# EAGLE design MacroBoard (EAGLE 9.6.2)
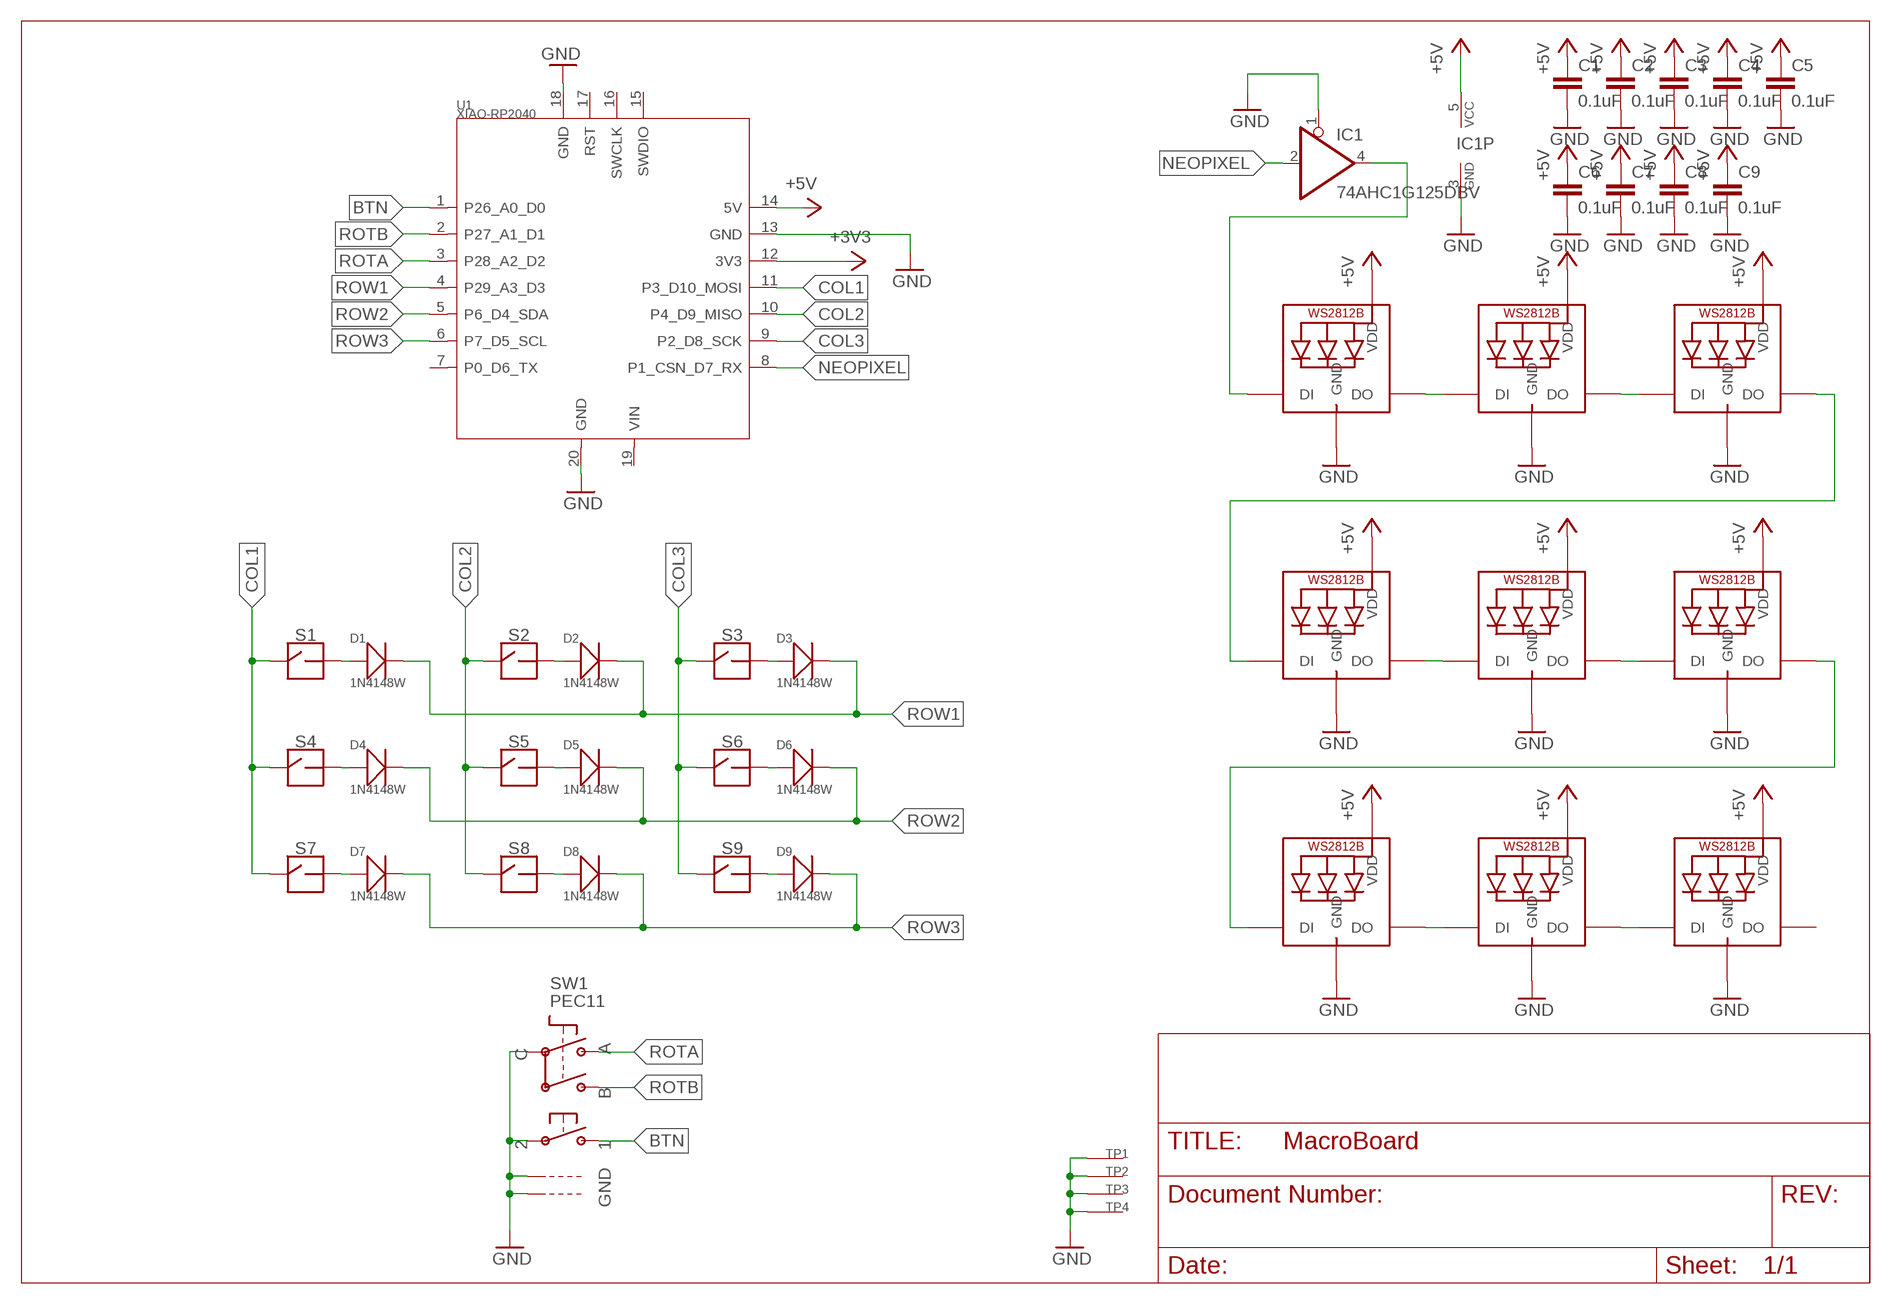
[diagram p0: schematic, sheet 1]

## Parts
C1  0.1uF  C-EUC0805K  [C0805K]
C2  0.1uF  C-EUC0805K  [C0805K]
C3  0.1uF  C-EUC0805K  [C0805K]
C4  0.1uF  C-EUC0805K  [C0805K]
C5  0.1uF  C-EUC0805K  [C0805K]
C6  0.1uF  C-EUC0805K  [C0805K]
C7  0.1uF  C-EUC0805K  [C0805K]
C8  0.1uF  C-EUC0805K  [C0805K]
C9  0.1uF  C-EUC0805K  [C0805K]
D1  1N4148W  SMD-DIODE-SCHOTTKY-20V-1A(SOD-123)  [SOD-123]
D2  1N4148W  SMD-DIODE-SCHOTTKY-20V-1A(SOD-123)  [SOD-123]
D3  1N4148W  SMD-DIODE-SCHOTTKY-20V-1A(SOD-123)  [SOD-123]
D4  1N4148W  SMD-DIODE-SCHOTTKY-20V-1A(SOD-123)  [SOD-123]
D5  1N4148W  SMD-DIODE-SCHOTTKY-20V-1A(SOD-123)  [SOD-123]
D6  1N4148W  SMD-DIODE-SCHOTTKY-20V-1A(SOD-123)  [SOD-123]
D7  1N4148W  SMD-DIODE-SCHOTTKY-20V-1A(SOD-123)  [SOD-123]
D8  1N4148W  SMD-DIODE-SCHOTTKY-20V-1A(SOD-123)  [SOD-123]
D9  1N4148W  SMD-DIODE-SCHOTTKY-20V-1A(SOD-123)  [SOD-123]
IC1  74AHC1G125DBV  [SOT23-5]
LED1  WS2812B_SK6812E  [NEO3535_REVERSE]
LED2  WS2812B_SK6812E  [NEO3535_REVERSE]
LED3  WS2812B_SK6812E  [NEO3535_REVERSE]
LED4  WS2812B_SK6812E  [NEO3535_REVERSE]
LED5  WS2812B_SK6812E  [NEO3535_REVERSE]
LED6  WS2812B_SK6812E  [NEO3535_REVERSE]
LED7  WS2812B_SK6812E  [NEO3535_REVERSE]
LED8  WS2812B_SK6812E  [NEO3535_REVERSE]
LED9  WS2812B_SK6812E  [NEO3535_REVERSE]
S1  SOCKET  KBD_SWITCH_KAILH_SOCKETBOX_JADE_KAILH_SOCKET  [KAILH_SOCKET]
S2  SOCKET  KBD_SWITCH_KAILH_SOCKETBOX_JADE_KAILH_SOCKET  [KAILH_SOCKET]
S3  SOCKET  KBD_SWITCH_KAILH_SOCKETBOX_JADE_KAILH_SOCKET  [KAILH_SOCKET]
S4  SOCKET  KBD_SWITCH_KAILH_SOCKETBOX_JADE_KAILH_SOCKET  [KAILH_SOCKET]
S5  SOCKET  KBD_SWITCH_KAILH_SOCKETBOX_JADE_KAILH_SOCKET  [KAILH_SOCKET]
S6  SOCKET  KBD_SWITCH_KAILH_SOCKETBOX_JADE_KAILH_SOCKET  [KAILH_SOCKET]
S7  SOCKET  KBD_SWITCH_KAILH_SOCKETBOX_JADE_KAILH_SOCKET  [KAILH_SOCKET]
S8  SOCKET  KBD_SWITCH_KAILH_SOCKETBOX_JADE_KAILH_SOCKET  [KAILH_SOCKET]
S9  SOCKET  KBD_SWITCH_KAILH_SOCKETBOX_JADE_KAILH_SOCKET  [KAILH_SOCKET]
SW1  PEC11  ENCODER_PLUS_SWITCH_BOURNS_PEC11  [PEC11+SWITCH]
TP1  SEWTAP_SMTNUTM3  [SMT_NUT_3MM]
TP2  SEWTAP_SMTNUTM3  [SMT_NUT_3MM]
TP3  SEWTAP_SMTNUTM3  [SMT_NUT_3MM]
TP4  SEWTAP_SMTNUTM3  [SMT_NUT_3MM]
U1  XIAO-RP2040  [XIAO-SAMD21/RP2040-MODULE14P-2.54-21X17.8MM]

## Nets
+3V3: U1.12(3V3)
+5V: C1.1 C2.1 C3.1 C4.1 C5.1 C6.1 C7.1 C8.1 C9.1 IC1.5(VCC) LED1.1-VDD(VDD) LED2.1-VDD(VDD) LED3.1-VDD(VDD) LED4.1-VDD(VDD) LED5.1-VDD(VDD) LED6.1-VDD(VDD) LED7.1-VDD(VDD) LED8.1-VDD(VDD) LED9.1-VDD(VDD) U1.14(5V)
BTN: SW1.P$1 U1.1(P26_A0_D0)
COL1: S1.1 S4.1 S7.1 U1.11(P3_D10_MOSI)
COL2: S2.1 S5.1 S8.1 U1.10(P4_D9_MISO)
COL3: S3.1 S6.1 S9.1 U1.9(P2_D8_SCK)
GND: C1.2 C2.2 C3.2 C4.2 C5.2 C6.2 C7.2 C8.2 C9.2 IC1.1(OE) IC1.3(GND) LED1.3-GND(GND) LED2.3-GND(GND) LED3.3-GND(GND) LED4.3-GND(GND) LED5.3-GND(GND) LED6.3-GND(GND) LED7.3-GND(GND) LED8.3-GND(GND) LED9.3-GND(GND) SW1.P$2 SW1.P$C SW1.P$GND1 SW1.P$GND2 TP1.P$1(SEW) TP2.P$1(SEW) TP3.P$1(SEW) TP4.P$1(SEW) U1.13(GND) U1.18(GND) U1.20(GND)
N$1: LED8.2-DOUT(DO) LED9.4-DIN(DI)
N$2: LED7.2-DOUT(DO) LED8.4-DIN(DI)
N$3: LED5.2-DOUT(DO) LED6.4-DIN(DI)
N$4: LED6.2-DOUT(DO) LED7.4-DIN(DI)
N$5: LED4.2-DOUT(DO) LED5.4-DIN(DI)
N$6: LED3.2-DOUT(DO) LED4.4-DIN(DI)
N$7: LED1.2-DOUT(DO) LED2.4-DIN(DI)
N$8: LED2.2-DOUT(DO) LED3.4-DIN(DI)
N$9: IC1.4(O) LED1.4-DIN(DI)
N$13: D1.+ S1.2
N$14: D4.+ S4.2
N$15: D7.+ S7.2
N$16: D2.+ S2.2
N$17: D5.+ S5.2
N$18: D8.+ S8.2
N$19: D3.+ S3.2
N$20: D6.+ S6.2
N$21: D9.+ S9.2
NEOPIXEL: IC1.2(I) U1.8(P1_CSN_D7_RX)
ROTA: SW1.P$A U1.3(P28_A2_D2)
ROTB: SW1.P$B U1.2(P27_A1_D1)
ROW1: D1.- D2.- D3.- U1.4(P29_A3_D3)
ROW2: D4.- D5.- D6.- U1.5(P6_D4_SDA)
ROW3: D7.- D8.- D9.- U1.6(P7_D5_SCL)
Unconnected: LED9.2-DOUT(DO) U1.7(P0_D6_TX) U1.15(SWDIO) U1.16(SWCLK) U1.17(RST) U1.19(VIN)

## Library data of the parts
C1-C9 = rcl:C-EU: CAPACITOR, European symbol; SPICEPREFIX: C
D1-D9 = OPL_Discrete_Semiconductor:SMD-DIODE-SCHOTTKY-20V-1A(SOD-123): 304020034; MPN: B5819W; VALUE: 20V-1A
IC1 = 74xx-little-de:74*1G125: Single Bus Buffer Gate with 3-State Output; SPICEPREFIX: J
LED1-LED9 = microbuilder:WS2812B
S1-S9 = adafruit_electromech:KBD_SWITCH_KAILH_SOCKET
SW1 = adafruit_electromech:ENCODER_PLUS_SWITCH: Rotary Encoder with Built-In Switch PEC11 - 24 Step, PEC11-4215F-S24 - http://www.adafruit.com/products/377
TP1-TP4 = adafruit_electromech:SEWTAP
U1 = Seeed Studio XIAO Series:XIAO-RP2040: Seeed Studio XIAO RP2040 v1.22 - Raspberry Pi RP2040 Microcontroller - 32-bit 133MHz Dual-Core ARM® Cortex® M0+processor Seeed SKU: 102010428 Seeed Studio XIAO RP2040 is a microcontroller using the Raspberry Pi RP2040 chip. The MCU runs at up to 133MHz. It is built with rich interfaces in a tiny thumb size and fully supports Arduino, MicroPython, and CircuitPython. The onboard interfaces are enough for developing multiple applications. Buy now <https://www.seeedstudio.com/XIAO-RP2040-v1-0-p-5026.html> Wiki <https://wiki.seeedstudio.com/XIAO-RP2040/>

## Board
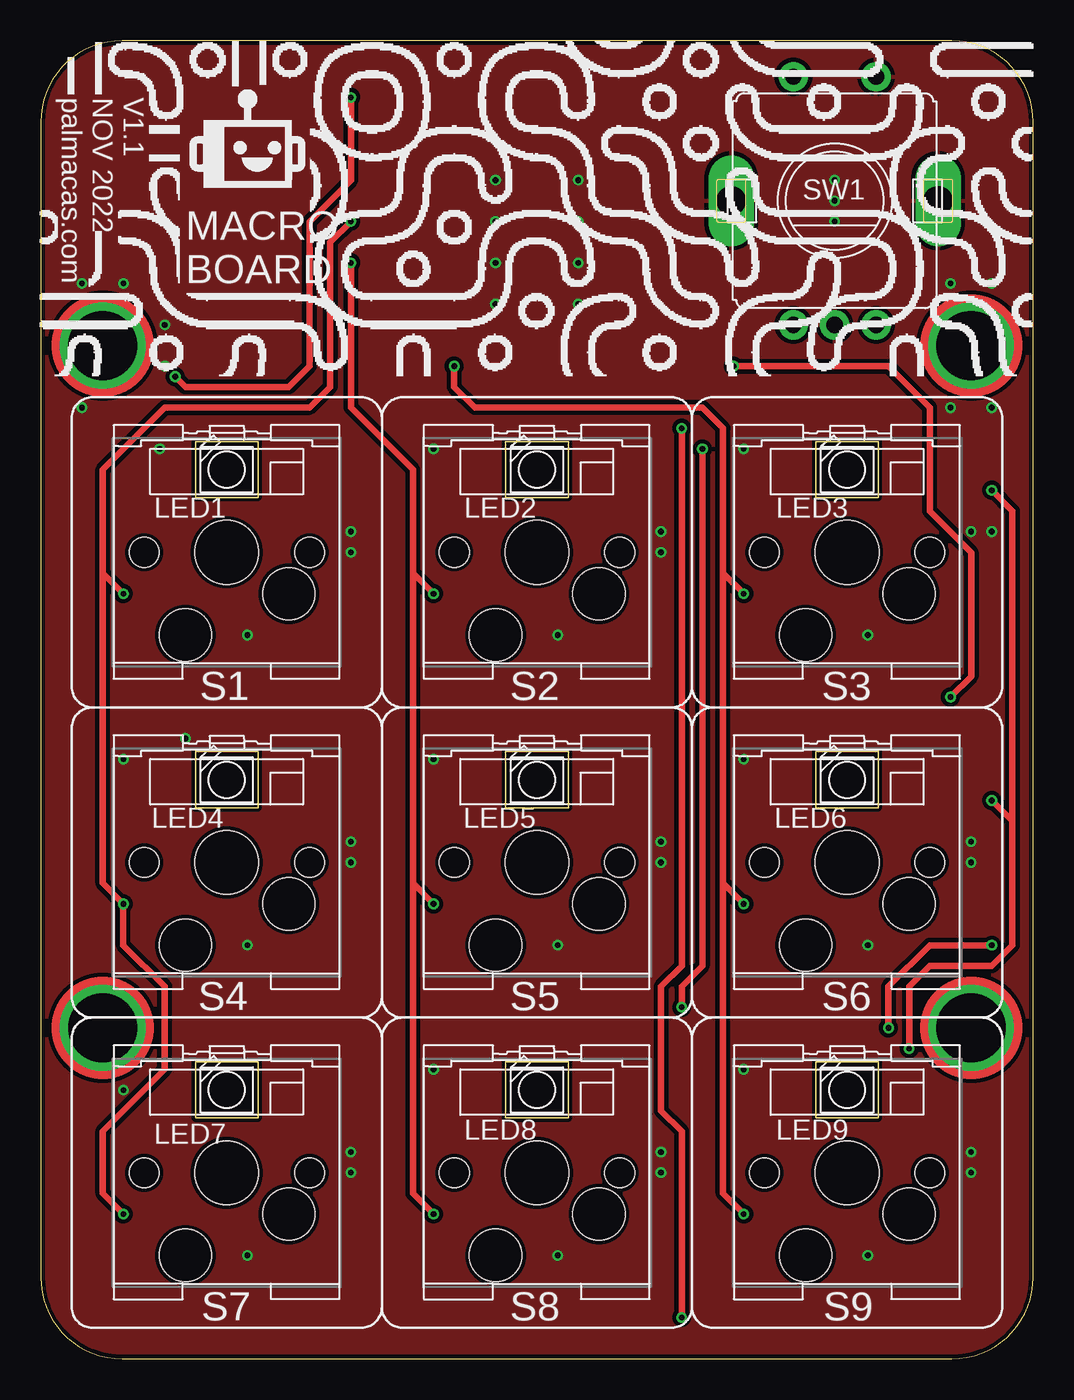
[diagram p1: board, top side]
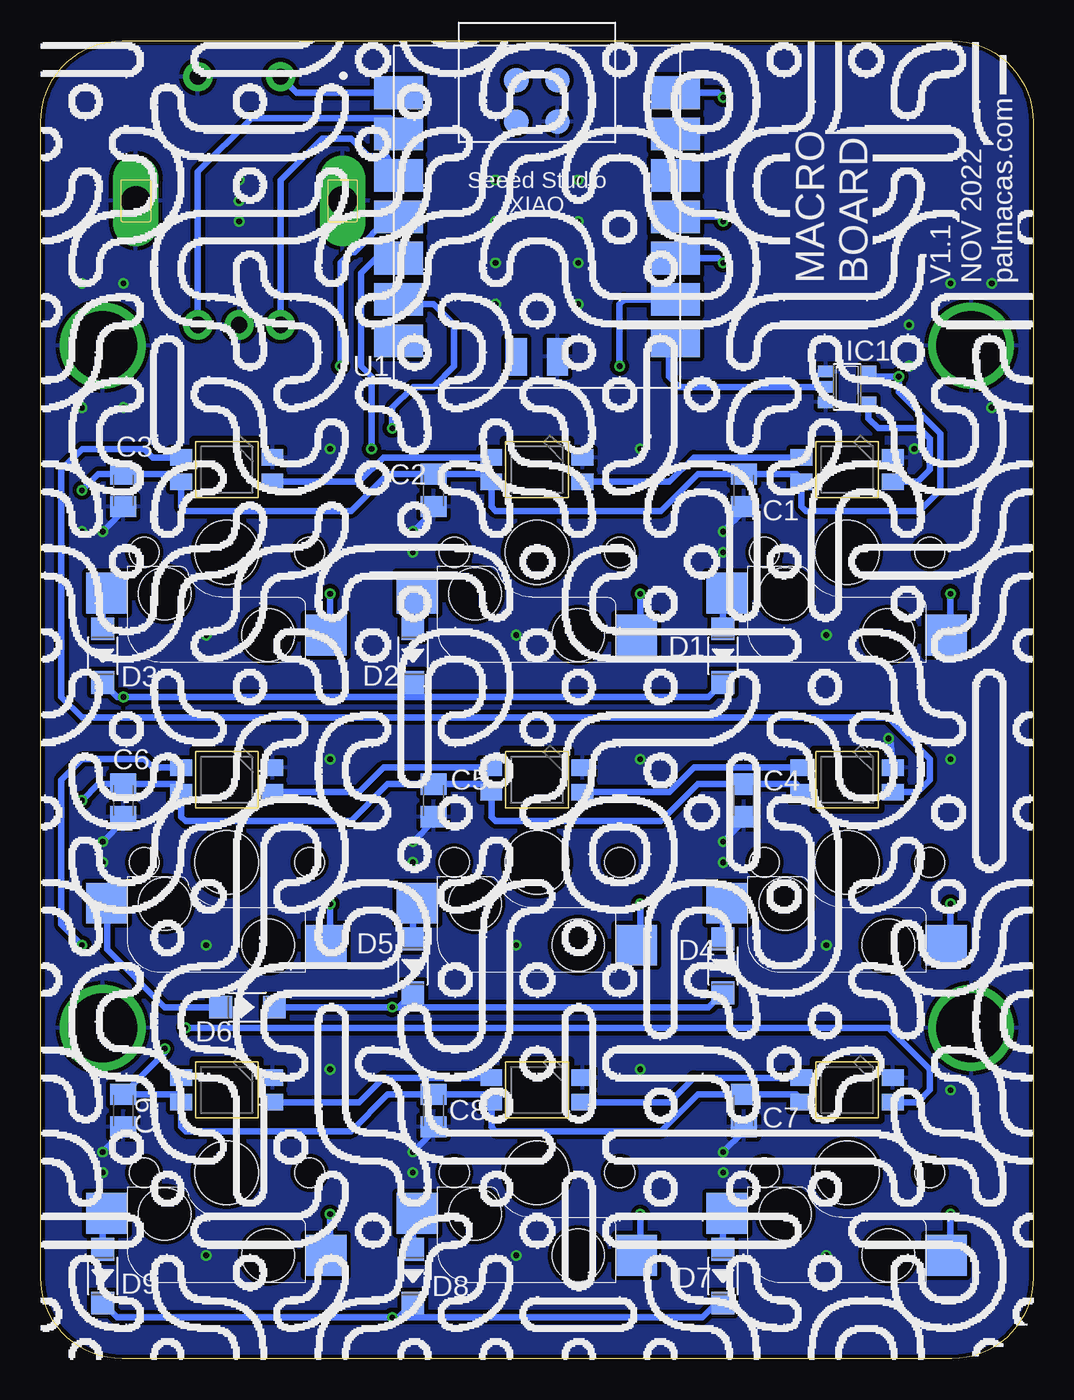
[diagram p2: board, bottom side, seen from below]

Size 60.96 x 80.95 mm. Coordinates in mm from the lower left corner, seen from the top.
Outline: 60.96,5 60.96,75.95 arc90 55.96,80.95 5,80.95 arc90 0,75.95 0,5 arc90 5,0 55.96,0 arc90 60.96,5
Copper layers (1*16): Top 0.035mm / dielectric 1.5mm / Bottom 0.035mm
Design rules "SeeedStudio_2layer_DRU_no_angle_20140221": minimum track width 6mil, minimum drill 12mil, track to track 6mil, track to pad 6mil, pad to pad 6mil, via to via 6mil, smd to smd 0mil, copper to edge 10mil, drill to drill 10mil, minimum pad ring 10mil, minimum via ring 6mil, stop-mask expansion 2mil, vias tented up to drill 100mil, thermal gap 10mil

### Footprints (pad centres in the part's own frame; a part is rotated, then mirrored left to right if it is on the bottom)
C0805K = smd 1.3 x 1.6: 1 -1,0; 2 1,0
SOD-123 = smd 1.397 x 1.397: + -1.651,0; - 1.651,0
SOT23-5 = smd 0.69 x 0.99: 1 -0.95,-1.29; 2 0,-1.29; 3 0.95,-1.29; 4 0.95,1.3; 5 -0.95,1.3
MICROBUILDER_NEO3535_REVERSE = smd 1.333 x 1.016 bottom: 1-VDD 2.802,-0.75; 2-DOUT 2.802,0.75; 3-GND -2.802,0.75; 4-DIN -2.802,-0.75
ADAFRUIT_ELECTROMECH_KAILH_SOCKET = smd 2.55 x 2.5 bottom: 1 6.09,5.08; 2 -7.36,2.5 | hole 3.9: 0,0 | hole 3.2: 2.54,5.08; -3.81,2.54 | hole 1.813: 5.08,0; -5.08,0
ADAFRUIT_ELECTROMECH_PEC11+SWITCH = drill 1 pad 1.8: P$1 -2.54,7.62; P$2 2.54,7.62; P$A -2.54,-7.62; P$B 2.54,-7.62; P$C 0,-7.62 | drill 1.8 pad 2.8 long: P$GND1 -6.35,0; P$GND2 6.35,0
SMT_NUT_3MM = drill 4.25 pad 4.572: P$1 0,0
SEEED-STUDIO-XIAO-SERIES_XIAO-SAMD21/RP2040-MODULE14P-2.54-21X17.8MM = smd 3 x 2: 1 -8.5,7.62; 2 -8.5,5.08; 3 -8.5,2.54; 4 -8.5,0; 5 -8.5,-2.54; 6 -8.5,-5.08; 7 -8.5,-7.62; 8 8.5,-7.62; 9 8.5,-5.08; 10 8.5,-2.54; 11 8.5,0; 12 8.5,2.54; 13 8.5,5.08; 14 8.5,7.62 | smd 1.5 x 1.5: 15 -1.27,8.39; 16 1.27,8.39; 17 -1.27,5.85; 18 1.27,5.85 | smd 1.3 x 2.3: 19 -1.27,-8.6; 20 1.27,-8.6

### Placement (x,y rotation side)
C1  17.78,53.34 270 bottom
C2  36.83,53.34 270 bottom
C3  55.88,53.34 270 bottom
C4  17.78,34.29 270 bottom
C5  36.83,34.29 270 bottom
C6  55.88,34.29 270 bottom
C7  17.78,15.24 270 bottom
C8  36.83,15.24 270 bottom
C9  55.88,15.24 270 bottom
D1  19.05,43.18 270 bottom
D2  38.1,43.18 270 bottom
D3  57.15,43.18 270 bottom
D4  19.05,24.13 270 bottom
D5  38.1,24.13 270 bottom
D6  48.26,21.59 0 bottom
D7  19.05,5.08 270 bottom
D8  38.1,5.08 270 bottom
D9  57.15,5.08 270 bottom
IC1  11.43,59.69 270 bottom
LED1  MICROBUILDER_WS2812B_SK6812E  [MICROBUILDER_NEO3535_REVERSE]  11.43,54.61 0 top
LED2  MICROBUILDER_WS2812B_SK6812E  [MICROBUILDER_NEO3535_REVERSE]  30.48,54.61 0 top
LED3  MICROBUILDER_WS2812B_SK6812E  [MICROBUILDER_NEO3535_REVERSE]  49.53,54.61 0 top
LED4  MICROBUILDER_WS2812B_SK6812E  [MICROBUILDER_NEO3535_REVERSE]  11.43,35.56 0 top
LED5  MICROBUILDER_WS2812B_SK6812E  [MICROBUILDER_NEO3535_REVERSE]  30.48,35.56 0 top
LED6  MICROBUILDER_WS2812B_SK6812E  [MICROBUILDER_NEO3535_REVERSE]  49.53,35.56 0 top
LED7  MICROBUILDER_WS2812B_SK6812E  [MICROBUILDER_NEO3535_REVERSE]  11.43,16.51 0 top
LED8  MICROBUILDER_WS2812B_SK6812E  [MICROBUILDER_NEO3535_REVERSE]  30.48,16.51 0 top
LED9  MICROBUILDER_WS2812B_SK6812E  [MICROBUILDER_NEO3535_REVERSE]  49.53,16.51 0 top
S1  SOCKET  [ADAFRUIT_ELECTROMECH_KAILH_SOCKET]  11.43,49.53 180 top
S2  SOCKET  [ADAFRUIT_ELECTROMECH_KAILH_SOCKET]  30.48,49.53 180 top
S3  SOCKET  [ADAFRUIT_ELECTROMECH_KAILH_SOCKET]  49.53,49.53 180 top
S4  SOCKET  [ADAFRUIT_ELECTROMECH_KAILH_SOCKET]  11.43,30.48 180 top
S5  SOCKET  [ADAFRUIT_ELECTROMECH_KAILH_SOCKET]  30.48,30.48 180 top
S6  SOCKET  [ADAFRUIT_ELECTROMECH_KAILH_SOCKET]  49.53,30.48 180 top
S7  SOCKET  [ADAFRUIT_ELECTROMECH_KAILH_SOCKET]  11.43,11.43 180 top
S8  SOCKET  [ADAFRUIT_ELECTROMECH_KAILH_SOCKET]  30.48,11.43 180 top
S9  SOCKET  [ADAFRUIT_ELECTROMECH_KAILH_SOCKET]  49.53,11.43 180 top
SW1  PEC11  [ADAFRUIT_ELECTROMECH_PEC11+SWITCH]  48.77,71.12 0 top
TP1  3.81,20.32 0 top
TP2  57.15,20.32 0 top
TP3  3.81,62.23 0 top
TP4  57.15,62.23 0 top
U1  SEEED-STUDIO-XIAO-SERIES_XIAO-RP2040  [SEEED-STUDIO-XIAO-SERIES_XIAO-SAMD21/RP2040-MODULE14P-2.54-21X17.8MM]  30.48,70.14 0 bottom
U$2  [PALMACAS_AVATAR_BLACK#PNG]  12.7,74.93 0 top

### Tracks (layer width: path | path; a pad name or v marks a point on that pad's centre or on a via)
+5V  (via drill 0.35)
  Top 0.406: v58.42,53.34 59.69,52.07 59.69,33.02 | v58.42,34.29 59.69,33.02 | 59.69,33.02 59.69,25.4 58.42,24.13 54.61,24.13 53.34,22.86 v53.34,19.05 | v8.26,60.33 8.89,59.69 15.24,59.69 16.51,60.96 16.51,69.85 19.05,72.39 v19.05,77.47
  Bottom 0.406: LED4.1-VDD 14.56,35.29 C4.1 20.59,35.29 22.86,33.02 33.02,33.02 33.28,33.28 LED5.1-VDD 33.61,35.29 C5.1 39.64,35.29 41.91,33.02 52.07,33.02 52.33,33.28 LED6.1-VDD 52.66,35.29 C6.1 57.42,35.29 v58.42,34.29 | LED7.1-VDD 14.56,16.24 C7.1 20.59,16.24 22.86,13.97 33.02,13.97 33.28,14.23 LED8.1-VDD 33.61,16.24 C8.1 39.64,16.24 41.91,13.97 52.07,13.97 52.33,14.23 LED9.1-VDD 52.66,16.24 C9.1 53.34,18.78 v53.34,19.05 | v58.42,53.34 57.42,54.34 C3.1 52.66,54.34 LED3.1-VDD 52.33,52.33 52.07,52.07 41.91,52.07 39.64,54.34 C2.1 33.61,54.34 LED2.1-VDD 33.28,52.33 33.02,52.07 22.86,52.07 20.59,54.34 C1.1 14.56,54.34 LED1.1-VDD 14.23,52.33 13.97,52.07 6.99,52.07 5.71,53.34 5.71,56.83 8.26,59.37 v8.26,60.33 9.81,60.33 IC1.5 | v19.05,77.47 19.34,77.75 U1.14
BTN
  Bottom 0.406: U1.1 45.24,77.75 SW1.P$1
COL1  (via drill 0.35)
  Top 0.406: v5.08,8.89 3.81,10.16 3.81,13.97 7.62,17.78 7.62,22.86 5.08,25.4 v5.08,27.94 3.81,29.21 3.81,48.26 | 3.81,48.26 v5.08,46.99 | 3.81,48.26 3.81,54.61 7.62,58.42 16.51,58.42 17.78,59.69 17.78,68.58 v19.05,69.85
  Bottom 0.406: S7.1 5.08,6.61 v5.08,8.89 | S4.1 5.08,25.66 v5.08,27.94 | S1.1 5.08,44.71 v5.08,46.99 | v19.05,69.85 19.34,70.14 U1.11
COL2  (via drill 0.35)
  Top 0.406: v24.13,8.89 22.86,10.16 22.86,29.21 | v24.13,27.94 22.86,29.21 | v24.13,46.99 22.86,48.26 | 22.86,29.21 22.86,48.26 | v19.05,67.31 19.05,58.42 22.86,54.61 22.86,48.26
  Bottom 0.406: S8.1 24.13,6.61 v24.13,8.89 | S5.1 24.13,25.66 v24.13,27.94 | S2.1 24.13,44.71 v24.13,46.99 | v19.05,67.31 19.34,67.59 U1.10
COL3  (via drill 0.35)
  Top 0.406: v43.18,46.99 41.91,48.26 | v43.18,8.89 41.91,10.16 41.91,29.21 | v43.18,27.94 41.91,29.21 | 41.91,29.21 41.91,48.26 | 41.91,48.26 41.91,57.15 40.64,58.42 26.67,58.42 25.4,59.69 v25.4,60.96
  Bottom 0.406: S3.1 43.18,44.71 v43.18,46.99 | S9.1 43.18,6.61 v43.18,8.89 | S6.1 43.18,25.66 v43.18,27.94 | v25.4,60.96 25.4,64.77 25.11,65.06 U1.9
GND  (via drill 0.35)
  Bottom 0.406: v19.05,31.75 17.78,33.02 C4.2 | v19.05,12.7 17.78,13.97 C7.2 | v38.1,12.7 36.83,13.97 C8.2 | v57.15,12.7 55.88,13.97 C9.2 | v57.15,31.75 55.88,33.02 C6.2 | v38.1,31.75 36.83,33.02 C5.2 | v19.05,50.8 17.78,52.07 C1.2 | v38.1,50.8 36.83,52.07 C2.2 | C3.2 55.88,52.07 v57.15,50.8 | LED4.3-GND 8.78,37.99 v8.89,38.1
  other vias: 19.05,30.48 57.15,30.48 57.15,11.43 38.1,11.43 19.05,11.43 19.05,49.53 58.42,50.8 5.08,36.83 24.13,36.83 43.18,36.83 5.08,16.51 24.13,17.78 43.18,17.78 7.3,55.88 27.94,72.39 33.02,72.39 27.94,69.85 33.02,69.85 33.02,67.31 27.94,67.31 43.18,55.88 24.13,55.88 27.94,64.77 33.02,64.77 48.77,72.39 48.77,71.12 48.77,69.85 58.42,66.04 55.88,66.04 55.88,58.42 58.42,58.42 2.54,58.42 7.62,63.5 5.08,66.04 2.54,66.04 7.62,60.96 38.1,49.53 38.1,30.48 50.8,25.4 31.75,25.4 12.7,25.4 12.7,6.35 31.75,6.35 50.8,6.35 12.7,44.45 31.75,44.45 50.8,44.45
  pour Bottom (isolate 0.254): 0,0 0,81.28 60.96,81.28 60.96,0
  pour Top (isolate 0.254): 0,0 60.96,0 60.96,81.28 0,81.28
N$1
  Bottom 0.406: LED8.2-DOUT 39.89,17.26 41.39,15.76 LED9.4-DIN
N$2
  Bottom 0.406: LED7.2-DOUT 20.84,17.26 22.34,15.76 LED8.4-DIN
N$3
  Bottom 0.406: LED5.2-DOUT 39.89,36.31 41.39,34.81 LED6.4-DIN
N$4  (via drill 0.35)
  Top 0.406: v52.07,20.32 52.07,22.86 54.61,25.4 v58.42,25.4
  Bottom 0.406: LED6.2-DOUT 54.09,36.31 54.61,36.83 58.42,36.83 59.69,35.56 59.69,26.67 v58.42,25.4 | LED7.4-DIN 7.1,15.76 6.35,16.51 6.35,17.78 8.89,20.32 v52.07,20.32
N$5
  Bottom 0.406: LED4.2-DOUT 20.84,36.31 22.34,34.81 LED5.4-DIN
N$6
  Bottom 0.406: LED3.2-DOUT 54.09,55.36 54.61,55.88 58.42,55.88 59.69,54.61 59.69,40.64 58.42,39.37 8.89,39.37 6.35,36.83 6.35,35.56 7.1,34.81 LED4.4-DIN
N$7
  Bottom 0.406: LED1.2-DOUT 20.84,55.36 22.34,53.86 LED2.4-DIN
N$8
  Bottom 0.406: LED2.2-DOUT 39.89,55.36 41.39,53.86 LED3.4-DIN
N$9
  Bottom 0.406: LED1.4-DIN 7.1,53.86 6.35,54.61 6.35,56.52 6.99,57.15 9.53,57.15 10.13,57.76 IC1.4
N$13
  Bottom 0.406: S1.2 19.05,46.77 D1.+
N$14
  Bottom 0.406: S4.2 19.05,27.72 D4.+
N$15
  Bottom 0.406: S7.2 19.05,8.67 D7.+
N$16
  Bottom 0.406: S2.2 38.1,46.77 D2.+
N$17
  Bottom 0.406: D5.+ 38.1,27.72 S5.2
N$18
  Bottom 0.406: S8.2 38.1,8.67 D8.+
N$19
  Bottom 0.406: S3.2 57.15,46.77 D3.+
N$20
  Bottom 0.406: D6.+ 53.34,21.59 56.89,25.14 S6.2
N$21
  Bottom 0.406: S9.2 57.15,8.67 D9.+
NEOPIXEL
  Bottom 0.406: U1.8 22.37,61.67 22.37,60.33 21.73,59.69 IC1.2
ROTA
  Bottom 0.406: SW1.P$A 46.23,72.39 43.69,74.93 41.88,74.93 40.81,73.86 39.71,73.86 U1.3
ROTB
  Bottom 0.406: SW1.P$B 51.31,72.9 48.01,76.2 39.52,76.2 U1.2
ROW1  (via drill 0.35)
  Top 0.406: v55.88,40.64 57.15,41.91 57.15,49.53 54.61,52.07 54.61,58.42 52.07,60.96 v42.55,60.96
  Bottom 0.406: v42.55,60.96 42.55,67.31 41.89,67.96 41.69,67.96 39.52,70.14 U1.4 | D3.- 56.26,40.64 v55.88,40.64 38.99,40.64 | D1.- 19.94,40.64 38.99,40.64 | D2.- 38.99,40.64
ROW2  (via drill 0.35)
  Top 0.406: v40.64,55.88 40.64,24.13 39.37,22.86 v39.37,21.59
  Bottom 0.406: D4.- 19.94,21.59 v39.37,21.59 | v39.37,21.59 38.99,21.59 D5.- | v39.37,21.59 D6.- | v40.64,55.88 40.64,60.33 41.27,60.96 41.27,66.67 40.35,67.59 U1.5
ROW3  (via drill 0.35)
  Top 0.406: v39.37,2.54 39.37,13.97 38.1,15.24 38.1,22.86 39.37,24.13 v39.37,57.15
  Bottom 0.406: v39.37,57.15 39.37,58.42 38.1,59.69 36.83,59.69 35.56,60.96 35.56,63.5 36.83,64.77 38.7,64.77 U1.6 | D7.- 19.43,3.43 20.32,2.54 v39.37,2.54 | D9.- 56.26,2.54 v39.37,2.54 | D8.- 38.99,2.54 v39.37,2.54

### Text on the board
tPlace: V1.1 / NOV 2022 / palmacas.com | MACRO / BOARD
bPlace: V1.1 / NOV 2022 / palmacas.com | MACRO / BOARD